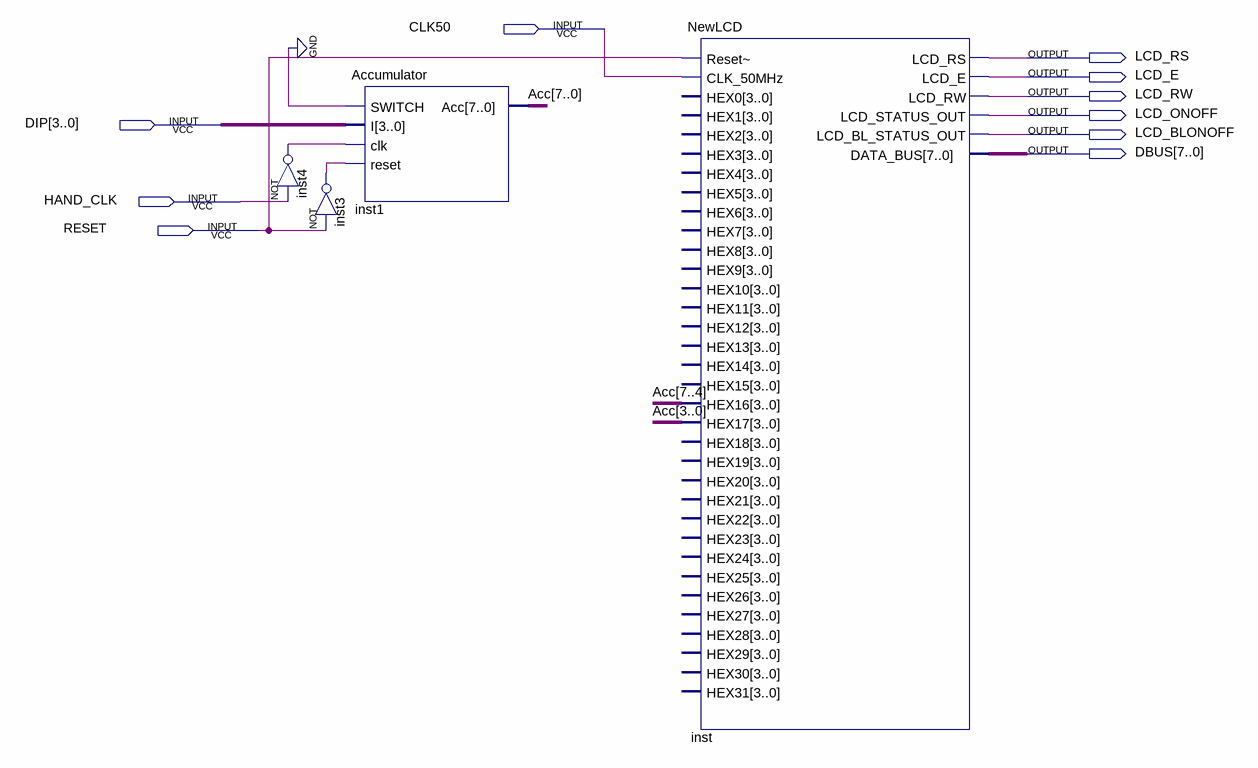
[diagram p0: schematic sheet]
// Quartus schematic AccumulatorLCD.bdf as structural Verilog: 4 symbols, 10 pins
module AccumulatorLCD (
  input  CLK50,
  input  [3:0] DIP,
  input  HAND_CLK,
  input  RESET,
  output LCD_RS,
  output LCD_E,
  output LCD_RW,
  output LCD_ONOFF,
  output LCD_BLONOFF,
  output [7:0] DBUS
);

  wire inst3_out, inst4_out;
  wire [7:0] Acc;

  not inst4 (inst4_out, HAND_CLK);
  Accumulator inst1 (.SWITCH(1'b0), .I(DIP), .clk(inst4_out), .reset(inst3_out), .Acc(Acc));
  not inst3 (inst3_out, RESET);
  NewLCD inst (
    .\Reset~ (RESET), .CLK_50MHz(CLK50), .HEX16(Acc[7:4]), .HEX17(Acc[3:0]), .LCD_RS(LCD_RS), .LCD_E(LCD_E),
    .LCD_RW(LCD_RW), .LCD_STATUS_OUT(LCD_ONOFF), .LCD_BL_STATUS_OUT(LCD_BLONOFF), .DATA_BUS(DBUS));  // open: HEX0, HEX1, HEX2, HEX3, HEX4, HEX5, HEX6, HEX7, HEX8, HEX9, HEX10, HEX11, HEX12, HEX13, HEX14, HEX15, HEX18, HEX19, HEX20, HEX21, HEX22, HEX23, HEX24, HEX25, HEX26, HEX27, HEX28, HEX29, HEX30, HEX31
endmodule
